# Altium project MIET_PCBD_Project.PrjPcb
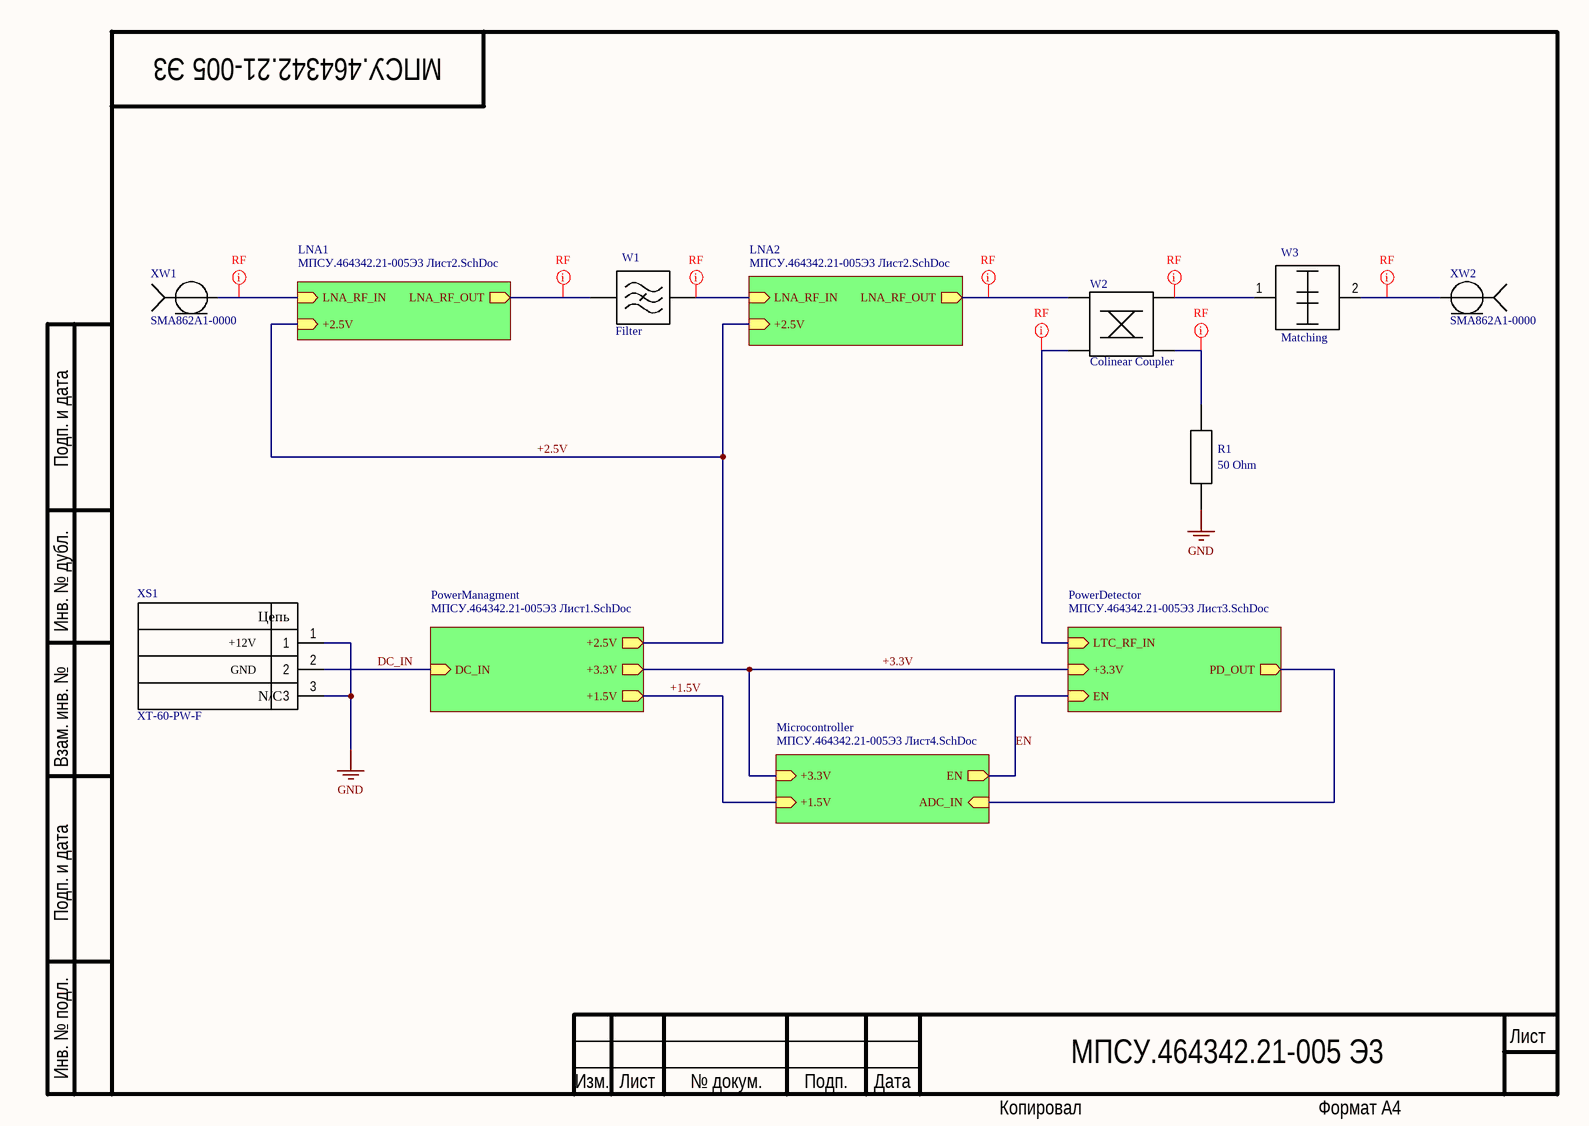
[diagram p0: МПСУ.464342.21-005Э3 Лист5.SchDoc]
Наименование: Приемная ячейка усиления и фильтрации с детектированием мощности; Наименование1: Приемная ячейка усиления и; Наименование2: фильтрации с детектированием; Наименование3: мощности; Наименование_PCB: Приемная ячейка усиления и фильтрации с детектированием мощности; Обозначение: МПСУ.464342.21-001; Обозначение_PCB: МПСУ.464342.21-001; Обозначение_Код: МПСУ.464342.21-001; Формат_PCB: А4, А3; Характер_работы: ЗамДир; п_Доп_графа: Лялин; п_Доп_графа_Р: Лялин; п_Пров: Приходько; п_Пров_Р: Приходько; п_Разраб: Лазба; п_Разраб_Р: Лазба
5 sheets, 63 parts. Net scope: hierarchical (ports join the sheet entries above them; power ports are global).
Board file: МПСУ.464342.21-005T5M.PcbDoc
Sheets:
  МПСУ.464342.21-005Э3 Лист5.SchDoc
    LNA2 = МПСУ.464342.21-005Э3 Лист2.SchDoc
    LNA1 = МПСУ.464342.21-005Э3 Лист2.SchDoc
    PowerManagment = МПСУ.464342.21-005Э3 Лист1.SchDoc
    Microcontroller = МПСУ.464342.21-005Э3 Лист4.SchDoc
    PowerDetector = МПСУ.464342.21-005Э3 Лист3.SchDoc

## Sheet МПСУ.464342.21-005Э3 Лист5.SchDoc
size 297 x 209 mm; Address1: Address1; Address2: Address2; Address3: Address3; Address4: Address4; SheetNumber: 1; SheetTotal: 5; Scale: 1:1; Обозначение документа: МПСУ.464342.21-005 Э3; Номер листа: 5

### Parts
R1  50 Ohm  [RESC160X80X60L30N]
W1  Filter  [MFilter8_5G]  (net tie, no BOM)
W2  Colinear Coupler  [CLCoupler]  (net tie, no BOM)
W3  Matching  [MATCHING_MAIN_OUT]  (net tie, no BOM)
XS1  XT-60-PW-F  Net2: GND  Net1: +12V  [XT-60-PW-F]
XW1  SMA862A1-0000  [SMA862A1-0000]
XW2  SMA862A1-0000  [SMA862A1-0000]

### Sub-sheets
LNA1 = МПСУ.464342.21-005Э3 Лист2.SchDoc: +2.5V (in), LNA_RF_IN (in), LNA_RF_OUT (out)
LNA2 = МПСУ.464342.21-005Э3 Лист2.SchDoc: +2.5V (in), LNA_RF_IN (in), LNA_RF_OUT (out)
Microcontroller = МПСУ.464342.21-005Э3 Лист4.SchDoc: +1.5V (in), +3.3V (in), EN (out), ADC_IN (in)
PowerDetector = МПСУ.464342.21-005Э3 Лист3.SchDoc: LTC_RF_IN (in), +3.3V (in), EN (in), PD_OUT (out)
PowerManagment = МПСУ.464342.21-005Э3 Лист1.SchDoc: DC_IN (in), +2.5V (out), +3.3V (out), +1.5V (out)

### Nets
GND: R1.1 XS1.1 XS1.3
+1.5V: sheet PowerManagment/+1.5V, sheet Microcontroller/+1.5V
+2.5V: sheet LNA2/+2.5V, sheet LNA1/+2.5V, sheet PowerManagment/+2.5V
+3.3V: sheet PowerManagment/+3.3V, sheet Microcontroller/+3.3V, sheet PowerDetector/+3.3V
ADC_IN: sheet Microcontroller/ADC_IN, sheet PowerDetector/PD_OUT
DC_IN: XS1.2 ; sheet PowerManagment/DC_IN
EN: sheet Microcontroller/EN, sheet PowerDetector/EN
LNA_RF_IN: W1.2 ; sheet LNA2/LNA_RF_IN
LNA_RF_IN: XW1.1 ; sheet LNA1/LNA_RF_IN  [a separate net that carries the same name]
LNA_RF_OUT: W1.1 ; sheet LNA1/LNA_RF_OUT
LNA_RF_OUT: W2.1 ; sheet LNA2/LNA_RF_OUT  [a separate net that carries the same name]
LTC_RF_IN: W2.4 ; sheet PowerDetector/LTC_RF_IN
NetR1_2: R1.2 W2.3
NetW2_2: W2.2 W3.1
NetW3_2: W3.2 XW2.1

### Layout directives
net class RF: LNA_RF_IN, LNA_RF_OUT, LTC_RF_IN, NetR1_2, NetW2_2, NetW3_2

### Notes on the sheet
- Подп. и дата
- Инв. № дубл.
- Взам. инв. №
- Инв. № подл.
- Изм.
- Лист
- № докум.
- Подп.
- Дата
- Копировал
- Формат А4
- (in symbol XT-60-PW-F) Цепь; N/C

### Library data of the parts
R1 = Resistor: Resistor, generic; Power: 5 W; DCV: 50 V; Value: 50 Ohm; PartNumber: *; Tolerance: *; Manufacturer: *; Package: 0603
W1 = Filter 8.5G: Bandpass filter, Fc 8.50GHz, BW  500 MHz, type - Coupled Microstrip Filter, diel RO4003 0.5 oz ED 20 mil
W2 = CLCoupler: Coupler 40 dB, diel RO4003 0.5 oz ED 20 mil
W3 = Matching_1
XS1 = XT-60-PW-F: Header, Right-angle, 2x1; Manufactorer: Changzhou Amass Electronics CO.LTD.; PartNumber: XT-60-PW-F; ComponentLink1Description: DataSheet; ComponentLink1URL: https://www.tme.eu/ru/Document/9b8d0c5eb7094295f3d3112c214d3ade/XT60PW%20SPEC.pdf; Category: Connector
XW1 XW2 = SMA862A1-0000: SMA Jack For Panel Receptacle 50Ohm JYEBAO; PartNumber: SMA862A1-0000

## Sheet МПСУ.464342.21-005Э3 Лист2.SchDoc
size 297 x 209 mm; Address1: Address1; Address2: Address2; Address3: Address3; Address4: Address4; SheetNumber: 3; SheetTotal: 5; Scale: 1:1; Обозначение документа: МПСУ.464342.21-005 Э3
Used 2 times, as channels LNA2, LNA1. Parts and nets are listed once, with the designators drawn on the sheet.
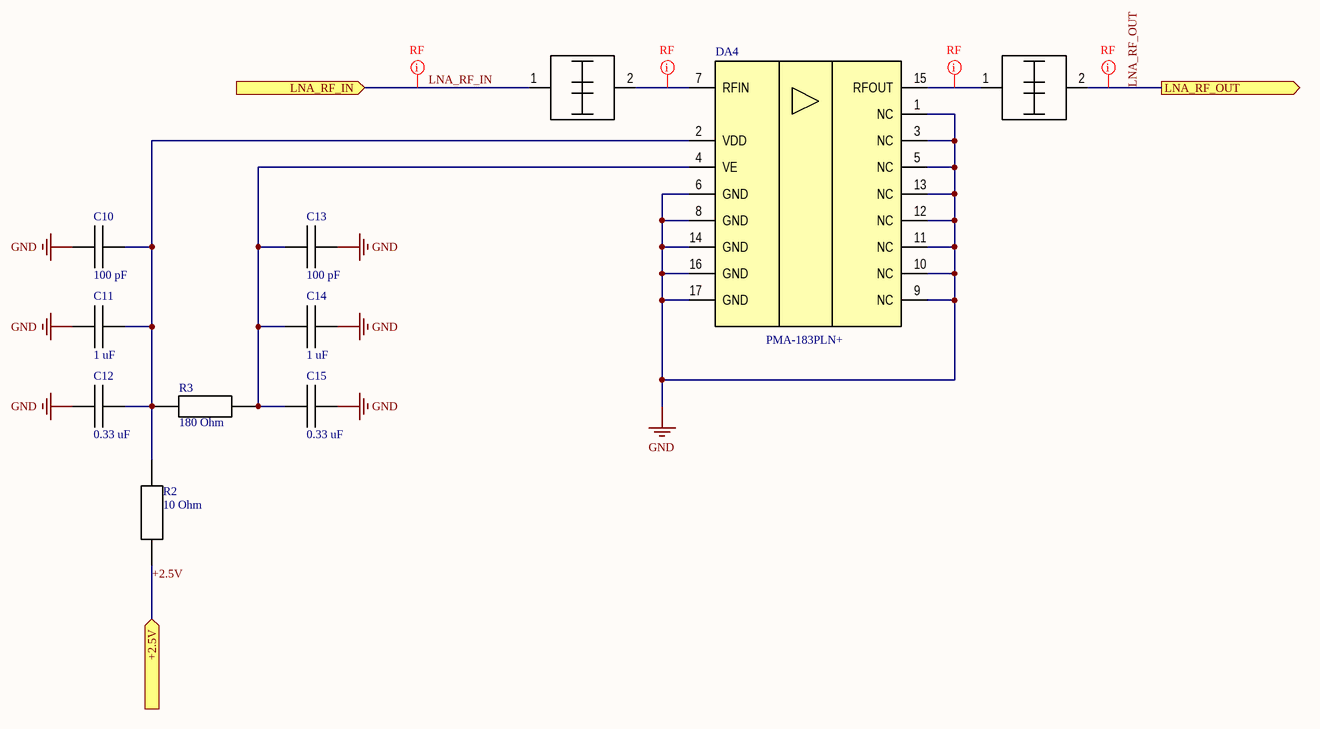
[diagram p1: МПСУ.464342.21-005Э3 Лист2.SchDoc]

### Parts
C10  100 pF  [CAPC100X50X55L20N]
C11  1 uF  [CAPC160X80X90L30N]
C12  0.33 uF  [CAPC200X125X95L50N]
C13  100 pF  [CAPC100X50X55L20N]
C14  1 uF  [CAPC160X80X90L30N]
C15  0.33 uF  [CAPC200X125X95L50N]
DA4  PMA-183PLN+  [JV2579]
R2  10 Ohm  [RESC100X50X40L25N]
R3  180 Ohm  [RESC100X50X40L25N]
W4  Matching  [MATCHING_LNA_IN]  (value not drawn)  (net tie, no BOM)
W5  Matching  [MATCHING_LNA_OUT]  (value not drawn)  (net tie, no BOM)

### Ports
+2.5V (in), LNA_RF_IN (in), LNA_RF_OUT (out)

### Nets
GND: C10.1 C11.1 C12.1 C13.2 C14.2 C15.2 DA4.1(NC) DA4.3(NC) DA4.5(NC) DA4.6(GND) DA4.8(GND) DA4.9(NC) DA4.10(NC) DA4.11(NC) DA4.12(NC) DA4.13(NC) DA4.14(GND) DA4.16(GND) DA4.17(GND)
+2.5V: R2.1 ; port +2.5V
LNA_RF_IN: W4.1 ; port LNA_RF_IN
LNA_RF_OUT: W5.2 ; port LNA_RF_OUT
NetC10_2: C10.2 C11.2 C12.2 DA4.2(VDD) R2.2 R3.1
NetC13_1: C13.1 C14.1 C15.1 DA4.4(VE) R3.2
NetDA4_7: DA4.7(RFIN) W4.2
NetDA4_15: DA4.15(RFOUT) W5.1

### Channels
LNA2: designators C10=C16#1 C11=C17#1 C12=C18#1 C13=C19#1 C14=C20#1 C15=C21#1 DA4=DA5#1 R2=R4#1 R3=R5#1 W4=W6#1 W5=W7; ports +2.5V=+2.5V LNA_RF_IN=LNA_RF_IN LNA_RF_OUT=LNA_RF_OUT
LNA1: ports +2.5V=+2.5V LNA_RF_IN=LNA_RF_IN LNA_RF_OUT=LNA_RF_OUT

### Layout directives
net class RF: LNA_RF_IN, LNA_RF_OUT, NetDA5#1_7, NetDA5#1_15

### Notes on the sheet
- Подп. и дата
- Инв. № дубл.
- Взам. инв. №
- Инв. № подл.
- Изм.
- Лист
- № докум.
- Подп.
- Дата
- Копировал
- Формат А4

### Library data of the parts
C10 C12 C13 C15 = Capacitor: Capacitor, generic; Tolerance: ± %10; PartNumber: *; VDC: *; Dielectric: *; Manufacturer: *
  C10 C13: Value: 100 pF; Package: 0402
  C12 C15: Value: 0.33 uF; Package: 0805
C11 C14 = Capacitor: Capacitor, generic; PartNumber: X5R; Tolerance: ± %10; VDC: 10 V; Value: 1 uF; Dielectric: *; Manufacturer: *; Package: 0603
DA4 = PMA-183PLN+: SMT Low Noise Amplifier, 6000 - 18000 MHz, 50Ω; Manufacturer: Mini-Circuits; PartNumber: PMA-183PLN+; ComponentLink1Description: ProductPage; ComponentLink1URL: https://www.minicircuits.com/WebStore/dashboard.html?model=PMA-183PLN%2B
R2 R3 = Resistor: Resistor, generic; Tolerance: ± 5%; Power: 63 mW; DCV: 25V; PartNumber: *; Manufacturer: *; Package: 0402
  R2: Value: 10 Ohm
  R3: Value: 180 Ohm
W4 W5 = Matching_1: Matching MTEE

## Sheet МПСУ.464342.21-005Э3 Лист1.SchDoc
size 209 x 297 mm; Address1: Address1; Address2: Address2; Address3: Address3; Address4: Address4; SheetNumber: 2; SheetTotal: 5; Scale: 1:1; Разраб.: Лазба; Обозначение документа: МПСУ.464342.21-005 Э3; Пров.: Приходько; Общее количество листов: 5; Наименование организации: МИЭТ; Наименование изделия 1: Плата; Наименование изделия 2: Схема электрическая; Наименование изделия 3: принципиальная; Нач. отд.: Замдир; Фамилия нач. отд.: Лялин
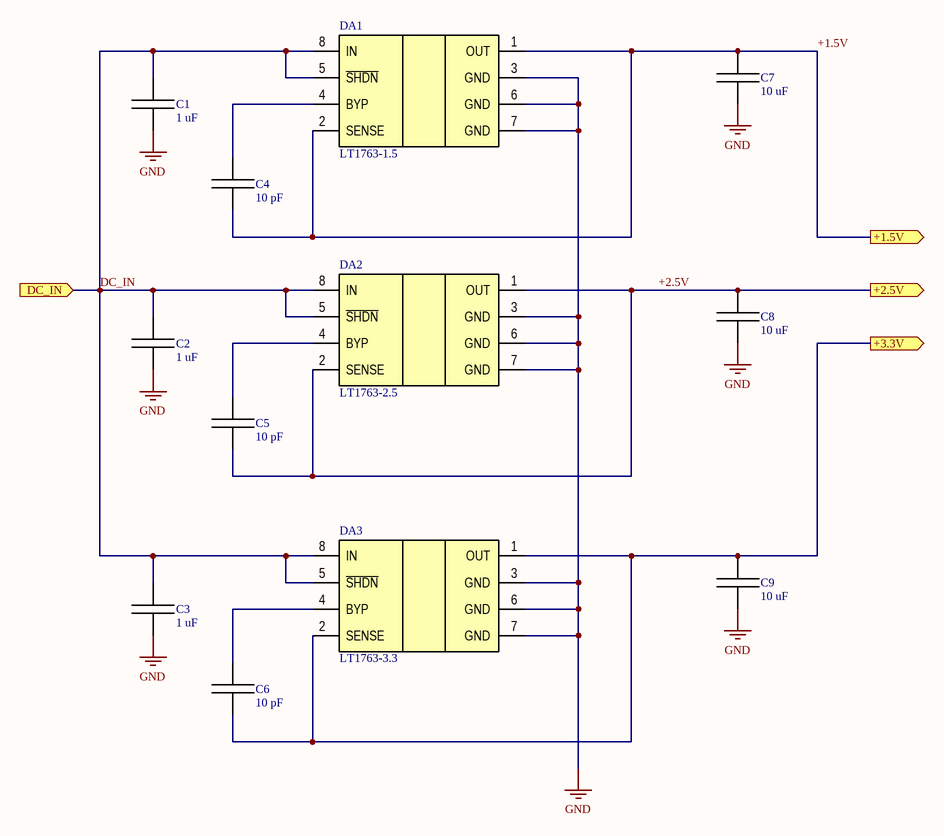
[diagram p2: МПСУ.464342.21-005Э3 Лист1.SchDoc]

### Parts
C1  1 uF  [CAPC160X80X90L30N]
C2  1 uF  [CAPC160X80X90L30N]
C3  1 uF  [CAPC160X80X90L30N]
C4  10 pF  [CAPC160X80X90L30N]
C5  10 pF  [CAPC160X80X90L30N]
C6  10 pF  [CAPC160X80X90L30N]
C7  10 uF  [CAPC160X80X90L30N]
C8  10 uF  [CAPC160X80X90L30N]
C9  10 uF  [CAPC160X80X90L30N]
DA1  LT1763-1.5  [SOIC8P127_490X600X175L83X41N]
DA2  LT1763-2.5  [SOIC8P127_490X600X175L83X41N]
DA3  LT1763-3.3  [SOIC8P127_490X600X175L83X41N]

### Ports
+1.5V (out), +2.5V (out), +3.3V (out), DC_IN (in)

### Nets
GND: C1.1 C2.1 C3.1 C7.1 C8.1 C9.1 DA1.3(GND) DA1.6(GND) DA1.7(GND) DA2.3(GND) DA2.6(GND) DA2.7(GND) DA3.3(GND) DA3.6(GND) DA3.7(GND)
+1.5V: C4.1 C7.2 DA1.1(OUT) DA1.2(SENSE) ; port +1.5V
+2.5V: C5.1 C8.2 DA2.1(OUT) DA2.2(SENSE) ; port +2.5V
+3.3V: C6.1 C9.2 DA3.1(OUT) DA3.2(SENSE) ; port +3.3V
DC_IN: C1.2 C2.2 C3.2 DA1.5(~{SHDN}) DA1.8(IN) DA2.5(~{SHDN}) DA2.8(IN) DA3.5(~{SHDN}) DA3.8(IN) ; port DC_IN
NetC4_2: C4.2 DA1.4(BYP)
NetC5_2: C5.2 DA2.4(BYP)
NetC6_2: C6.2 DA3.4(BYP)

### Notes on the sheet
- Перв. примен.
- Справ. №
- Подп. и дата
- Инв. № дубл.
- Взам. инв. №
- Разраб.
- Изм.
- Лист
- № докум.
- Подп.
- Дата
- Лит.
- Масса
- Масштаб
- Пров.
- Т.контр.
- Листов
- Инв. № подл.
- Утв.
- Н.контр.
- Копировал
- Формат А4

### Library data of the parts
C1-C9 = Capacitor: Capacitor, generic; PartNumber: X7R; Tolerance: ± 10 %; VDC: 16 V; Dielectric: *; Manufacturer: *; Package: 0603
  C1-C3: Value: 1 uF
  C4-C6: Value: 10 pF
  C7-C9: Value: 10 uF
DA1-DA3 = LT1763: Micropower DC/DC Converters in SOIC8; Manufacturer: Analog Devices

## Sheet МПСУ.464342.21-005Э3 Лист4.SchDoc
size 297 x 209 mm; Address1: Address1; Address2: Address2; Address3: Address3; Address4: Address4; SheetNumber: 5; SheetTotal: 5; Scale: 1:1; Обозначение документа: МПСУ.464342.21-005 Э3
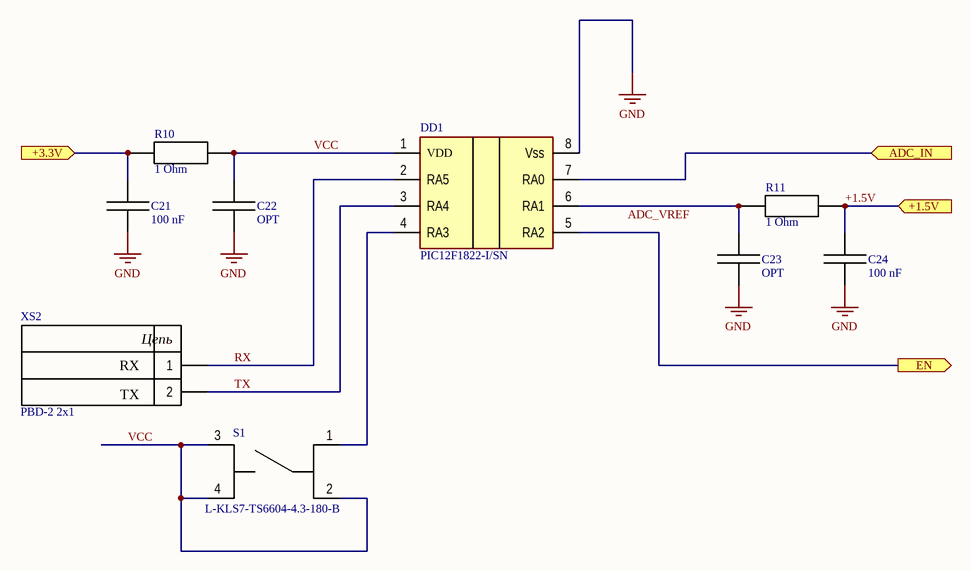
[diagram p3: МПСУ.464342.21-005Э3 Лист4.SchDoc]

### Parts
(Parts that share a designator on the sheet are numbered #1, #2 ... from top to bottom, then left to right.)
C21#2  100 nF  [CAPC100X50X55L20N]
C22  OPT  [CAPC100X50X55L20N]
C23  OPT  [CAPC100X50X55L20N]
C24  100 nF  [CAPC100X50X55L20N]
DD1  PIC12F1822-I/SN  [SN-SOIC127P600X175-8N]
R10  1 Ohm  [RESC100X50X40L25N]
R11  1 Ohm  [RESC100X50X40L25N]
S1  L-KLS7-TS6604-4.3-180-B  [DIP2_SOIC450P1000X350-4N]
XS2  PBD-2 2x1  [RHDRV2W45P254_1X2_304X500H500]

### Ports
+1.5V (in), +3.3V (in), ADC_IN (in), EN (out)

### Nets
GND: C21#2.1 C22.1 C23.1 C24.1 DD1.8(Vss)
+1.5V: C24.2 R11.2 ; port +1.5V
+3.3V: C21#2.2 R10.2 ; port +3.3V
ADC_IN: DD1.7(RA0) ; port ADC_IN
ADC_VREF: C23.2 DD1.6(RA1) R11.1
EN: DD1.5(RA2) ; port EN
RX: DD1.2(RA5) XS2.1
TX: DD1.3(RA4) XS2.2
VCC: C22.2 DD1.1(VDD) R10.1 S1.2 S1.3 S1.4
NetDD1_4: DD1.4(RA3) S1.1

### Notes on the sheet
- Подп. и дата
- Инв. № дубл.
- Взам. инв. №
- Инв. № подл.
- Изм.
- Лист
- № докум.
- Подп.
- Дата
- Копировал
- Формат А4
- (in symbol PBD-2) Цепь

### Library data of the parts
C21#2 C22-C24 = Capacitor: Capacitor, generic; PartNumber: *; Tolerance: *; VDC: *; Dielectric: *; Manufacturer: *; Package: 0402
  C21 C24: Value: 100 nF
  C22 C23: Value: OPT
DD1 = PIC12(L)F1822: 8-bit Flash Microcontrollers with XLP Technology 3.5 KB, 128 B; PartNumber: PIC12F1822-I/SN
R10 = Resistor: Resistor, generic; Tolerance: ± 5%; Power: 63 mW; DCV: 25 V; Value: 1 Ohm; PartNumber: *; Manufacturer: *; Package: 0402
R11 = Resistor: Resistor, generic; Value: 1 Ohm; PartNumber: *; Tolerance: *; Power: *; DCV: *; Manufacturer: *; Package: 0402
S1 = KLS7-TS6601-7: Tact Switch; Manufacturer: KLS electronic co ltd; PartNumber: L-KLS7-TS6604-4.3-180-B; ComponentLink1Description: DataSheet; ComponentLink1URL: https://static.chipdip.ru/lib/551/DOC001551970.pdf
XS2 = PBD-2: Header, Vertical Receptacle, 2.54 mm pitch 2x1; Net2: TX; Net1: RX; PartNumber: PBD-2 2x1

## Sheet МПСУ.464342.21-005Э3 Лист3.SchDoc
size 297 x 209 mm; Address1: Address1; Address2: Address2; Address3: Address3; Address4: Address4; SheetNumber: 4; SheetTotal: 5; Scale: 1:1; Обозначение документа: МПСУ.464342.21-005 Э3
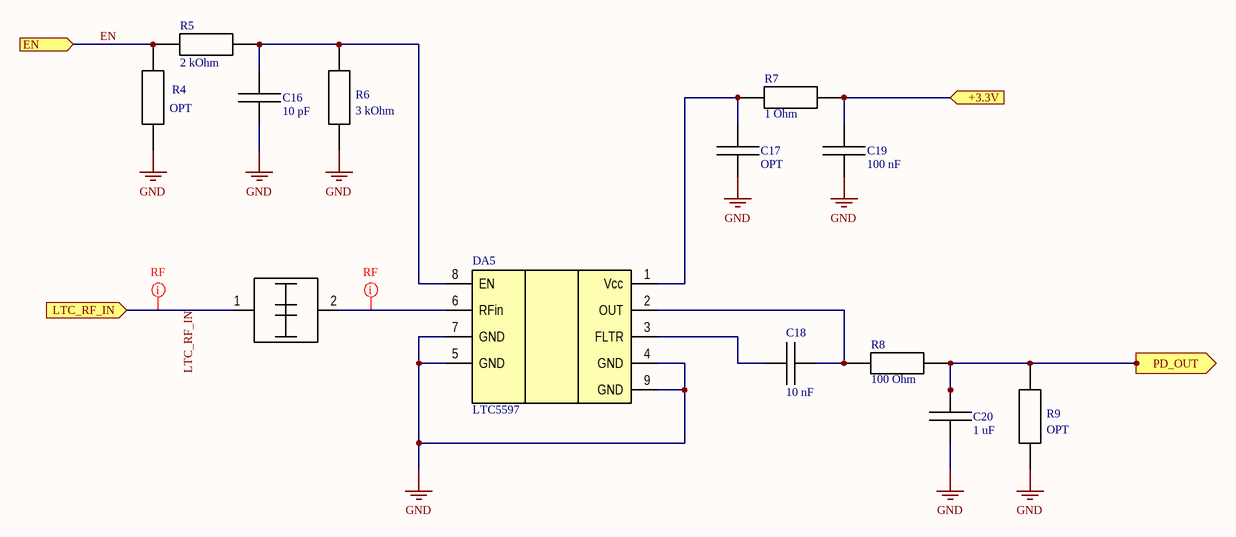
[diagram p4: МПСУ.464342.21-005Э3 Лист3.SchDoc]

### Parts
(Parts that share a designator on the sheet are numbered #1, #2 ... from top to bottom, then left to right.)
C16#2  10 pF  [CAPC100X50X55L20N]
C17#2  OPT  [CAPC100X50X55L20N]
C18#2  10 nF  [CAPC100X50X55L20N]
C19#2  100 nF  [CAPC100X50X55L20N]
C20#2  1 uF  [CAPC100X50X55L20N]
DA5#2  LTC5597  [LTC5597]
R4#2  OPT  [RESC100X50X40L25N]
R5#2  2 kOhm  [RESC100X50X40L25N]
R6  3 kOhm  [RESC100X50X40L25N]
R7  1 Ohm  [RESC100X50X40L25N]
R8  100 Ohm  [RESC100X50X40L25N]
R9  OPT  [RESC100X50X40L25N]
W6#2  Matching  [MATCHING_LTC_IN]  (value not drawn)  (net tie, no BOM)

### Ports
+3.3V (in), EN (in), LTC_RF_IN (in), PD_OUT (out)

### Nets
GND: C16#2.1 C17#2.1 C19#2.1 C20#2.1 DA5#2.4(GND) DA5#2.5(GND) DA5#2.7(GND) DA5#2.9(GND) R4#2.1 R6.1 R9.1
+3.3V: C19#2.2 R7.2 ; port +3.3V
ADC_IN: C20#2.2 R8.2 R9.2 ; port PD_OUT
EN: R4#2.2 R5#2.1 ; port EN
LTC_RF_IN: W6#2.1 ; port LTC_RF_IN
NetC16#2_2: C16#2.2 DA5#2.8(EN) R5#2.2 R6.2
NetC17#2_2: C17#2.2 DA5#2.1(Vcc) R7.1
NetC18#2_1: C18#2.1 DA5#2.3(FLTR)
NetC18#2_2: C18#2.2 DA5#2.2(OUT) R8.1
NetDA5#2_6: DA5#2.6(RFin) W6#2.2

### Layout directives
net class RF: LTC_RF_IN, NetDA5#2_6

### Notes on the sheet
- Подп. и дата
- Инв. № дубл.
- Взам. инв. №
- Инв. № подл.
- Изм.
- Лист
- № докум.
- Подп.
- Дата
- Копировал
- Формат А4

### Library data of the parts
C16#2 C17#2 C18#2 C19#2 C20#2 = Capacitor: Capacitor, generic; PartNumber: *; Tolerance: *; VDC: *; Dielectric: *; Manufacturer: *; Package: 0402
  C16: Value: 10 pF
  C17: Value: OPT
  C18: Value: 10 nF
  C19: Value: 100 nF
  C20: Value: 1 uF
DA5#2 = LTC5597: 100MHz to 70GHz Linear-in-dB RMS Power Detector with 35dB Dynamic Range; Manufacturer: Analog Devices; PartNumber: LTC5597; ComponentLink1Description: Product Page; ComponentLink1URL: https://www.analog.com/en/products/ltc5597.html#product-overview
R4#2 R5#2 R6-R9 = Resistor: as R10 on sheet МПСУ.464342.21-005Э3 Лист4; PartNumber: *; Manufacturer: *; Package: 0402
  R4 R9: Value: OPT
  R5: Value: 2 kOhm
  R6: Value: 3 kOhm
  R7: Value: 1 Ohm
  R8: Value: 100 Ohm
W6#2 = Matching_1

## Nets that join several sheets
GND: МПСУ.464342.21-005Э3 Лист5 (R1.1 XS1.1 XS1.3), LNA2 (19 pins), LNA1 (19 pins), МПСУ.464342.21-005Э3 Лист1 (15 pins), МПСУ.464342.21-005Э3 Лист4 (5 pins), МПСУ.464342.21-005Э3 Лист3 (11 pins)
+1.5V: МПСУ.464342.21-005Э3 Лист1 (C4.1 C7.2 DA1.1 DA1.2), МПСУ.464342.21-005Э3 Лист4 (C24.2 R11.2)
+2.5V: LNA2 (R4#1.1), LNA1 (R2.1), МПСУ.464342.21-005Э3 Лист1 (C5.1 C8.2 DA2.1 DA2.2)
+3.3V: МПСУ.464342.21-005Э3 Лист1 (C6.1 C9.2 DA3.1 DA3.2), МПСУ.464342.21-005Э3 Лист4 (C21#2.2 R10.2), МПСУ.464342.21-005Э3 Лист3 (C19#2.2 R7.2)
ADC_IN: МПСУ.464342.21-005Э3 Лист4 (DD1.7), МПСУ.464342.21-005Э3 Лист3 (C20#2.2 R8.2 R9.2)
DC_IN: МПСУ.464342.21-005Э3 Лист5 (XS1.2), МПСУ.464342.21-005Э3 Лист1 (9 pins)
EN: МПСУ.464342.21-005Э3 Лист4 (DD1.5), МПСУ.464342.21-005Э3 Лист3 (R4#2.2 R5#2.1)
LNA_RF_IN: МПСУ.464342.21-005Э3 Лист5 (W1.2), LNA2 (W6#1.1)
LNA_RF_IN: МПСУ.464342.21-005Э3 Лист5 (XW1.1), LNA1 (W4.1)
LNA_RF_OUT: МПСУ.464342.21-005Э3 Лист5 (W1.1), LNA1 (W5.2)
LNA_RF_OUT: МПСУ.464342.21-005Э3 Лист5 (W2.1), LNA2 (W7.2)
LTC_RF_IN: МПСУ.464342.21-005Э3 Лист5 (W2.4), МПСУ.464342.21-005Э3 Лист3 (W6#2.1)